# EAGLE schematic custom_keyboard (EAGLE 9.2.2)
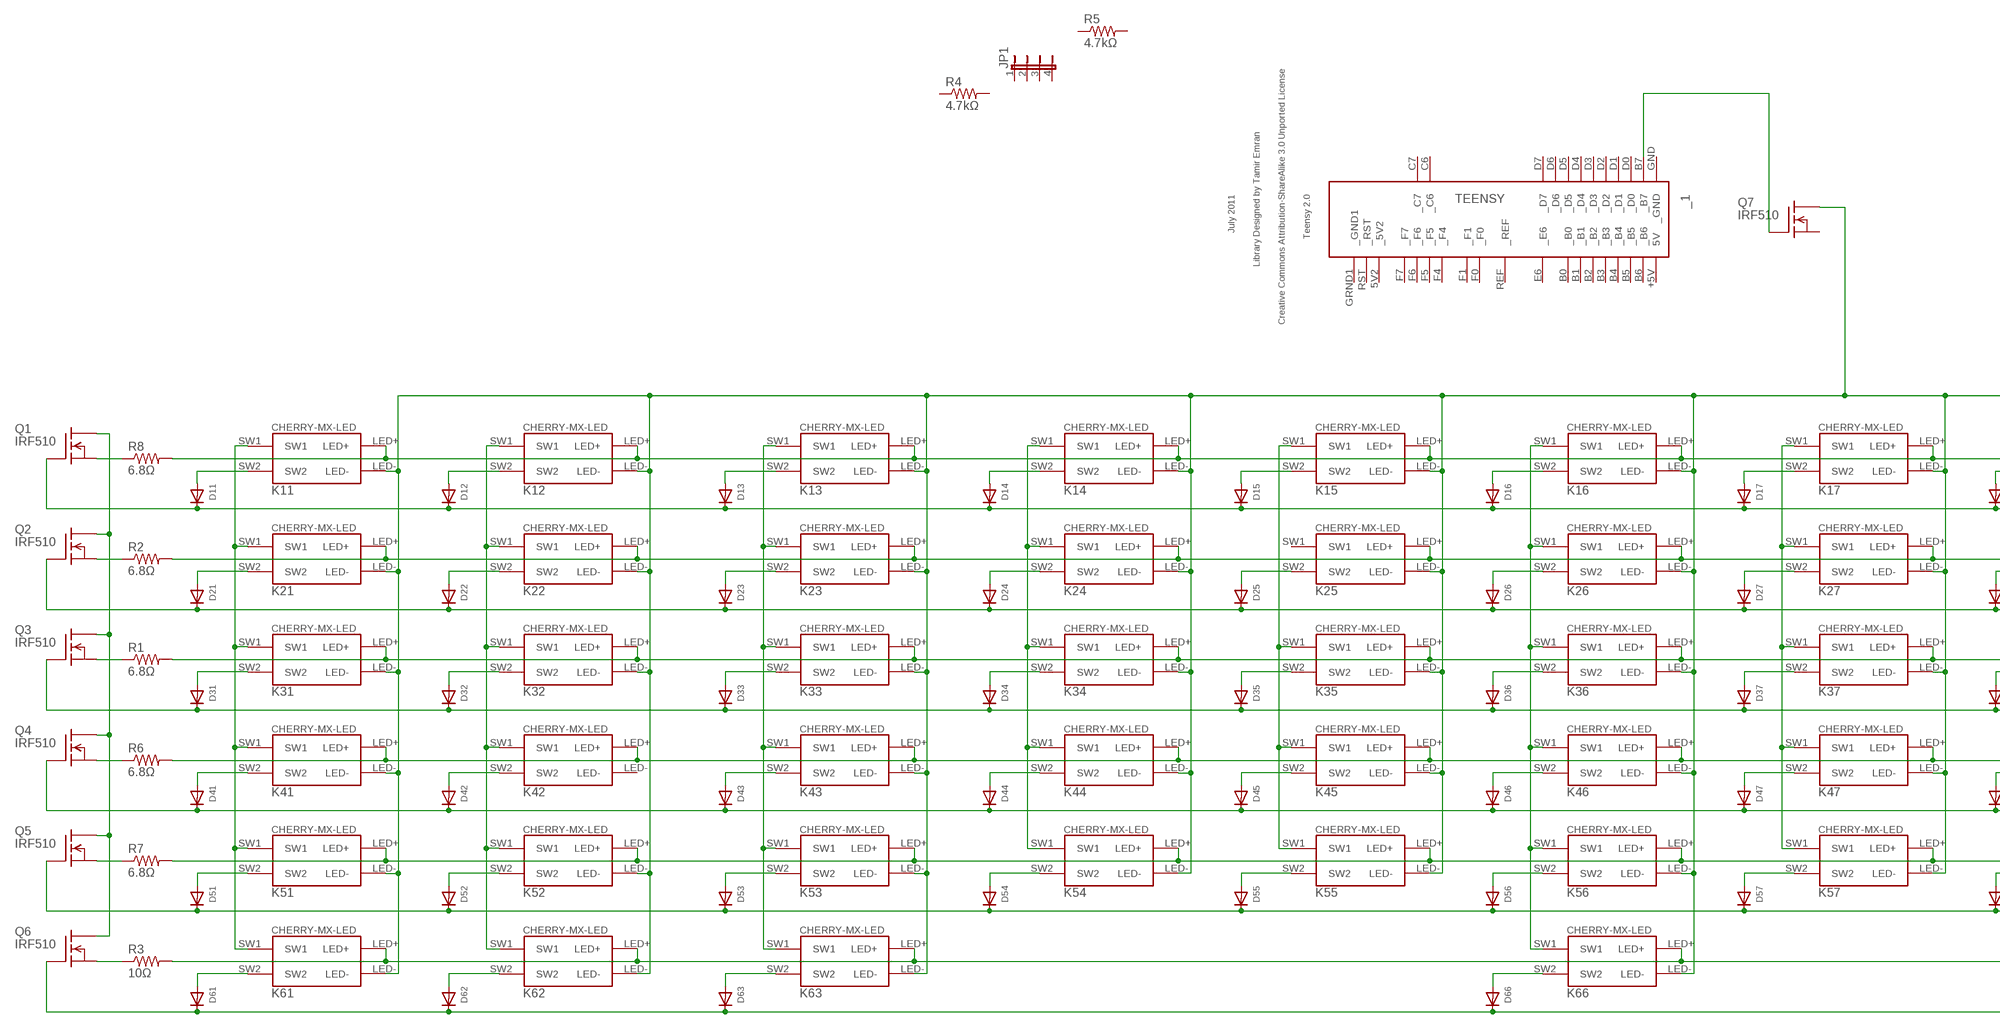
[diagram p0: schematic, sheet 1, part 1 of 2]
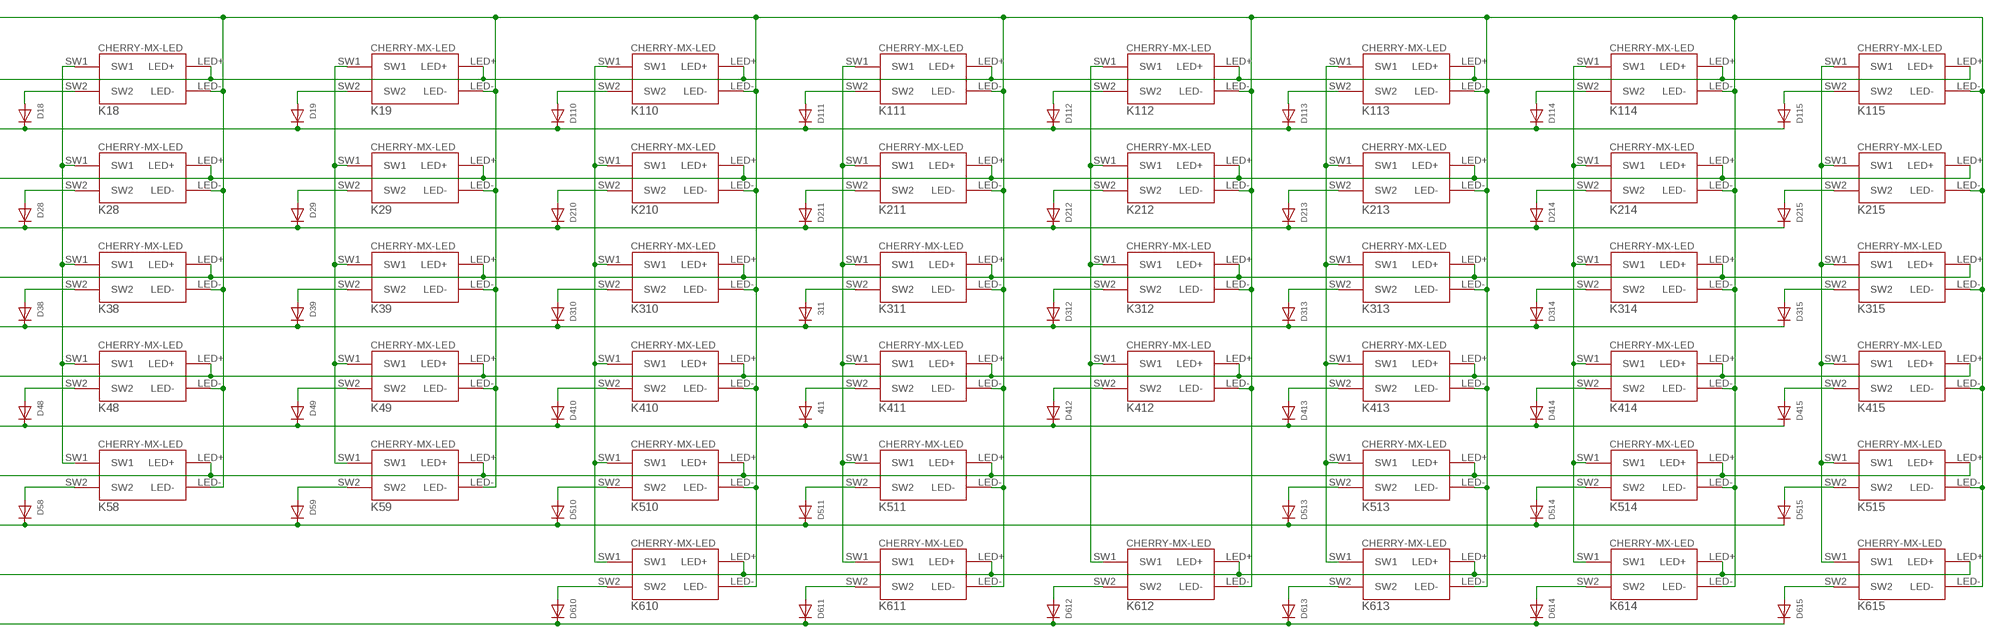
[diagram p1: schematic, sheet 1, part 2 of 2]

## Parts
311  DIODEDO-1N4148  [DO-1N4148]
411  DIODEDO-1N4148  [DO-1N4148]
_1  TEENSY  [TEENSY]
D11  DIODEDO-1N4148  [DO-1N4148]
D12  DIODEDO-1N4148  [DO-1N4148]
D13  DIODEDO-1N4148  [DO-1N4148]
D14  DIODEDO-1N4148  [DO-1N4148]
D15  DIODEDO-1N4148  [DO-1N4148]
D16  DIODEDO-1N4148  [DO-1N4148]
D17  DIODEDO-1N4148  [DO-1N4148]
D18  DIODEDO-1N4148  [DO-1N4148]
D19  DIODEDO-1N4148  [DO-1N4148]
D21  DIODEDO-1N4148  [DO-1N4148]
D22  DIODEDO-1N4148  [DO-1N4148]
D23  DIODEDO-1N4148  [DO-1N4148]
D24  DIODEDO-1N4148  [DO-1N4148]
D25  DIODEDO-1N4148  [DO-1N4148]
D26  DIODEDO-1N4148  [DO-1N4148]
D27  DIODEDO-1N4148  [DO-1N4148]
D28  DIODEDO-1N4148  [DO-1N4148]
D29  DIODEDO-1N4148  [DO-1N4148]
D31  DIODEDO-1N4148  [DO-1N4148]
D32  DIODEDO-1N4148  [DO-1N4148]
D33  DIODEDO-1N4148  [DO-1N4148]
D34  DIODEDO-1N4148  [DO-1N4148]
D35  DIODEDO-1N4148  [DO-1N4148]
D36  DIODEDO-1N4148  [DO-1N4148]
D37  DIODEDO-1N4148  [DO-1N4148]
D38  DIODEDO-1N4148  [DO-1N4148]
D39  DIODEDO-1N4148  [DO-1N4148]
D41  DIODEDO-1N4148  [DO-1N4148]
D42  DIODEDO-1N4148  [DO-1N4148]
D43  DIODEDO-1N4148  [DO-1N4148]
D44  DIODEDO-1N4148  [DO-1N4148]
D45  DIODEDO-1N4148  [DO-1N4148]
D46  DIODEDO-1N4148  [DO-1N4148]
D47  DIODEDO-1N4148  [DO-1N4148]
D48  DIODEDO-1N4148  [DO-1N4148]
D49  DIODEDO-1N4148  [DO-1N4148]
D51  DIODEDO-1N4148  [DO-1N4148]
D52  DIODEDO-1N4148  [DO-1N4148]
D53  DIODEDO-1N4148  [DO-1N4148]
D54  DIODEDO-1N4148  [DO-1N4148]
D55  DIODEDO-1N4148  [DO-1N4148]
D56  DIODEDO-1N4148  [DO-1N4148]
D57  DIODEDO-1N4148  [DO-1N4148]
D58  DIODEDO-1N4148  [DO-1N4148]
D59  DIODEDO-1N4148  [DO-1N4148]
D61  DIODEDO-1N4148  [DO-1N4148]
D62  DIODEDO-1N4148  [DO-1N4148]
D63  DIODEDO-1N4148  [DO-1N4148]
D66  DIODEDO-1N4148  [DO-1N4148]
D110  DIODEDO-1N4148  [DO-1N4148]
D111  DIODEDO-1N4148  [DO-1N4148]
D112  DIODEDO-1N4148  [DO-1N4148]
D113  DIODEDO-1N4148  [DO-1N4148]
D114  DIODEDO-1N4148  [DO-1N4148]
D115  DIODEDO-1N4148  [DO-1N4148]
D210  DIODEDO-1N4148  [DO-1N4148]
D211  DIODEDO-1N4148  [DO-1N4148]
D212  DIODEDO-1N4148  [DO-1N4148]
D213  DIODEDO-1N4148  [DO-1N4148]
D214  DIODEDO-1N4148  [DO-1N4148]
D215  DIODEDO-1N4148  [DO-1N4148]
D310  DIODEDO-1N4148  [DO-1N4148]
D312  DIODEDO-1N4148  [DO-1N4148]
D313  DIODEDO-1N4148  [DO-1N4148]
D314  DIODEDO-1N4148  [DO-1N4148]
D315  DIODEDO-1N4148  [DO-1N4148]
D410  DIODEDO-1N4148  [DO-1N4148]
D412  DIODEDO-1N4148  [DO-1N4148]
D413  DIODEDO-1N4148  [DO-1N4148]
D414  DIODEDO-1N4148  [DO-1N4148]
D415  DIODEDO-1N4148  [DO-1N4148]
D510  DIODEDO-1N4148  [DO-1N4148]
D511  DIODEDO-1N4148  [DO-1N4148]
D513  DIODEDO-1N4148  [DO-1N4148]
D514  DIODEDO-1N4148  [DO-1N4148]
D515  DIODEDO-1N4148  [DO-1N4148]
D610  DIODEDO-1N4148  [DO-1N4148]
D611  DIODEDO-1N4148  [DO-1N4148]
D612  DIODEDO-1N4148  [DO-1N4148]
D613  DIODEDO-1N4148  [DO-1N4148]
D614  DIODEDO-1N4148  [DO-1N4148]
D615  DIODEDO-1N4148  [DO-1N4148]
JP1  JP4E  [JP4]
K11  CHERRY-MX-LED  [CHERRY-MX-LED]
K12  CHERRY-MX-LED  [CHERRY-MX-LED]
K13  CHERRY-MX-LED  [CHERRY-MX-LED]
K14  CHERRY-MX-LED  [CHERRY-MX-LED]
K15  CHERRY-MX-LED  [CHERRY-MX-LED]
K16  CHERRY-MX-LED  [CHERRY-MX-LED]
K17  CHERRY-MX-LED  [CHERRY-MX-LED]
K18  CHERRY-MX-LED  [CHERRY-MX-LED]
K19  CHERRY-MX-LED  [CHERRY-MX-LED]
K21  CHERRY-MX-LED  [CHERRY-MX-LED]
K22  CHERRY-MX-LED  [CHERRY-MX-LED]
K23  CHERRY-MX-LED  [CHERRY-MX-LED]
K24  CHERRY-MX-LED  [CHERRY-MX-LED]
K25  CHERRY-MX-LED  [CHERRY-MX-LED]
K26  CHERRY-MX-LED  [CHERRY-MX-LED]
K27  CHERRY-MX-LED  [CHERRY-MX-LED]
K28  CHERRY-MX-LED  [CHERRY-MX-LED]
K29  CHERRY-MX-LED  [CHERRY-MX-LED]
K31  CHERRY-MX-LED  [CHERRY-MX-LED]
K32  CHERRY-MX-LED  [CHERRY-MX-LED]
K33  CHERRY-MX-LED  [CHERRY-MX-LED]
K34  CHERRY-MX-LED  [CHERRY-MX-LED]
K35  CHERRY-MX-LED  [CHERRY-MX-LED]
K36  CHERRY-MX-LED  [CHERRY-MX-LED]
K37  CHERRY-MX-LED  [CHERRY-MX-LED]
K38  CHERRY-MX-LED  [CHERRY-MX-LED]
K39  CHERRY-MX-LED  [CHERRY-MX-LED]
K41  CHERRY-MX-LED  [CHERRY-MX-LED]
K42  CHERRY-MX-LED  [CHERRY-MX-LED]
K43  CHERRY-MX-LED  [CHERRY-MX-LED]
K44  CHERRY-MX-LED  [CHERRY-MX-LED]
K45  CHERRY-MX-LED  [CHERRY-MX-LED]
K46  CHERRY-MX-LED  [CHERRY-MX-LED]
K47  CHERRY-MX-LED  [CHERRY-MX-LED]
K48  CHERRY-MX-LED  [CHERRY-MX-LED]
K49  CHERRY-MX-LED  [CHERRY-MX-LED]
K51  CHERRY-MX-LED  [CHERRY-MX-LED]
K52  CHERRY-MX-LED  [CHERRY-MX-LED]
K53  CHERRY-MX-LED  [CHERRY-MX-LED]
K54  CHERRY-MX-LED  [CHERRY-MX-LED]
K55  CHERRY-MX-LED  [CHERRY-MX-LED]
K56  CHERRY-MX-LED  [CHERRY-MX-LED]
K57  CHERRY-MX-LED  [CHERRY-MX-LED]
K58  CHERRY-MX-LED  [CHERRY-MX-LED]
K59  CHERRY-MX-LED  [CHERRY-MX-LED]
K61  CHERRY-MX-LED  [CHERRY-MX-LED]
K62  CHERRY-MX-LED  [CHERRY-MX-LED]
K63  CHERRY-MX-LED  [CHERRY-MX-LED]
K66  CHERRY-MX-LED  [CHERRY-MX-LED]
K110  CHERRY-MX-LED  [CHERRY-MX-LED]
K111  CHERRY-MX-LED  [CHERRY-MX-LED]
K112  CHERRY-MX-LED  [CHERRY-MX-LED]
K113  CHERRY-MX-LED  [CHERRY-MX-LED]
K114  CHERRY-MX-LED  [CHERRY-MX-LED]
K115  CHERRY-MX-LED  [CHERRY-MX-LED]
K210  CHERRY-MX-LED  [CHERRY-MX-LED]
K211  CHERRY-MX-LED  [CHERRY-MX-LED]
K212  CHERRY-MX-LED  [CHERRY-MX-LED]
K213  CHERRY-MX-LED  [CHERRY-MX-LED]
K214  CHERRY-MX-LED  [CHERRY-MX-LED]
K215  CHERRY-MX-LED  [CHERRY-MX-LED]
K310  CHERRY-MX-LED  [CHERRY-MX-LED]
K311  CHERRY-MX-LED  [CHERRY-MX-LED]
K312  CHERRY-MX-LED  [CHERRY-MX-LED]
K313  CHERRY-MX-LED  [CHERRY-MX-LED]
K314  CHERRY-MX-LED  [CHERRY-MX-LED]
K315  CHERRY-MX-LED  [CHERRY-MX-LED]
K410  CHERRY-MX-LED  [CHERRY-MX-LED]
K411  CHERRY-MX-LED  [CHERRY-MX-LED]
K412  CHERRY-MX-LED  [CHERRY-MX-LED]
K413  CHERRY-MX-LED  [CHERRY-MX-LED]
K414  CHERRY-MX-LED  [CHERRY-MX-LED]
K415  CHERRY-MX-LED  [CHERRY-MX-LED]
K510  CHERRY-MX-LED  [CHERRY-MX-LED]
K511  CHERRY-MX-LED  [CHERRY-MX-LED]
K513  CHERRY-MX-LED  [CHERRY-MX-LED]
K514  CHERRY-MX-LED  [CHERRY-MX-LED]
K515  CHERRY-MX-LED  [CHERRY-MX-LED]
K610  CHERRY-MX-LED  [CHERRY-MX-LED]
K611  CHERRY-MX-LED  [CHERRY-MX-LED]
K612  CHERRY-MX-LED  [CHERRY-MX-LED]
K613  CHERRY-MX-LED  [CHERRY-MX-LED]
K614  CHERRY-MX-LED  [CHERRY-MX-LED]
K615  CHERRY-MX-LED  [CHERRY-MX-LED]
Q1  IRF510  [TO220]
Q2  IRF510  [TO220]
Q3  IRF510  [TO220]
Q4  IRF510  [TO220]
Q5  IRF510  [TO220]
Q6  IRF510  [TO220]
Q7  IRF510  [TO220]
R1  6.8Ω  R-US_0411/12  [0411/12]
R2  6.8Ω  R-US_0411/12  [0411/12]
R3  10Ω  R-US_0411/12  [0411/12]
R4  4.7kΩ  R-US_0204/7  [0204/7]
R5  4.7kΩ  R-US_0204/7  [0204/7]
R6  6.8Ω  R-US_0411/12  [0411/12]
R7  6.8Ω  R-US_0411/12  [0411/12]
R8  6.8Ω  R-US_0411/12  [0411/12]

## Nets
N$1: D11.A K11.SW2
N$2: D12.A K12.SW2
N$3: D22.A K22.SW2
N$4: D21.A K21.SW2
N$5: D31.A K31.SW2
N$6: D41.A K41.SW2
N$7: D51.A K51.SW2
N$8: D61.A K61.SW2
N$9: D32.A K32.SW2
N$10: D42.A K42.SW2
N$11: D52.A K52.SW2
N$12: D62.A K62.SW2
N$13: D13.A K13.SW2
N$14: D23.A K23.SW2
N$15: D33.A K33.SW2
N$16: D43.A K43.SW2
N$17: D53.A K53.SW2
N$18: D63.A K63.SW2
N$19: D14.A K14.SW2
N$20: D24.A K24.SW2
N$21: D34.A K34.SW2
N$22: D44.A K44.SW2
N$23: D54.A K54.SW2
N$24: D11.C D12.C D13.C D14.C D15.C D16.C D17.C D18.C D19.C D110.C D111.C D112.C D113.C D114.C D115.C Q1.1(G)
N$25: D15.A K15.SW2
N$26: D25.A K25.SW2
N$27: D35.A K35.SW2
N$28: D45.A K45.SW2
N$29: D55.A K55.SW2
N$30: D21.C D22.C D23.C D24.C D25.C D26.C D27.C D28.C D29.C D210.C D211.C D212.C D213.C D214.C D215.C Q2.1(G)
N$31: D16.A K16.SW2
N$32: D26.A K26.SW2
N$33: D36.A K36.SW2
N$34: D46.A K46.SW2
N$35: D56.A K56.SW2
N$36: 311.C D31.C D32.C D33.C D34.C D35.C D36.C D37.C D38.C D39.C D310.C D312.C D313.C D314.C D315.C Q3.1(G)
N$37: D17.A K17.SW2
N$38: D27.A K27.SW2
N$39: D37.A K37.SW2
N$40: D47.A K47.SW2
N$41: D57.A K57.SW2
N$42: D66.A K66.SW2
N$43: D18.A K18.SW2
N$44: D28.A K28.SW2
N$45: D38.A K38.SW2
N$46: D48.A K48.SW2
N$47: D58.A K58.SW2
N$48: 411.C D41.C D42.C D43.C D44.C D45.C D46.C D47.C D48.C D49.C D410.C D412.C D413.C D414.C D415.C Q4.1(G)
N$49: D19.A K19.SW2
N$50: D29.A K29.SW2
N$51: D39.A K39.SW2
N$52: D49.A K49.SW2
N$53: D59.A K59.SW2
N$54: D51.C D52.C D53.C D54.C D55.C D56.C D57.C D58.C D59.C D510.C D511.C D513.C D514.C D515.C Q5.1(G)
N$55: D110.A K110.SW2
N$56: D210.A K210.SW2
N$57: D310.A K310.SW2
N$58: D410.A K410.SW2
N$59: D510.A K510.SW2
N$60: D610.A K610.SW2
N$61: D111.A K111.SW2
N$62: D211.A K211.SW2
N$63: 311.A K311.SW2
N$64: 411.A K411.SW2
N$65: D511.A K511.SW2
N$66: D611.A K611.SW2
N$67: D112.A K112.SW2
N$68: D212.A K212.SW2
N$69: D312.A K312.SW2
N$70: D412.A K412.SW2
N$71: D61.C D62.C D63.C D66.C D610.C D611.C D612.C D613.C D614.C D615.C Q6.1(G)
N$72: D612.A K612.SW2
N$73: D113.A K113.SW2
N$74: D213.A K213.SW2
N$75: D313.A K313.SW2
N$76: D413.A K413.SW2
N$77: D513.A K513.SW2
N$78: D613.A K613.SW2
N$79: D114.A K114.SW2
N$80: D214.A K214.SW2
N$81: D314.A K314.SW2
N$82: D414.A K414.SW2
N$83: D514.A K514.SW2
N$84: D614.A K614.SW2
N$85: D115.A K115.SW2
N$86: D215.A K215.SW2
N$87: D315.A K315.SW2
N$88: D415.A K415.SW2
N$89: D515.A K515.SW2
N$90: D615.A K615.SW2
N$91: K11.SW1 K21.SW1 K31.SW1 K41.SW1 K51.SW1 K61.SW1
N$92: K12.SW1 K22.SW1 K32.SW1 K42.SW1 K52.SW1 K62.SW1
N$93: K13.SW1 K23.SW1 K33.SW1 K43.SW1 K53.SW1 K63.SW1
N$94: K14.SW1 K24.SW1 K34.SW1 K44.SW1 K54.SW1
N$95: K115.SW1 K215.SW1 K315.SW1 K415.SW1 K515.SW1 K615.SW1
N$96: K114.SW1 K214.SW1 K314.SW1 K414.SW1 K514.SW1 K614.SW1
N$97: K113.SW1 K213.SW1 K313.SW1 K413.SW1 K513.SW1 K613.SW1
N$98: K112.SW1 K212.SW1 K312.SW1 K412.SW1 K612.SW1
N$99: K111.SW1 K211.SW1 K311.SW1 K411.SW1 K511.SW1 K611.SW1
N$100: K110.SW1 K210.SW1 K310.SW1 K410.SW1 K510.SW1 K610.SW1
N$101: K19.SW1 K29.SW1 K39.SW1 K49.SW1 K59.SW1
N$102: K18.SW1 K28.SW1 K38.SW1 K48.SW1 K58.SW1
N$103: K17.SW1 K27.SW1 K37.SW1 K47.SW1 K57.SW1
N$104: K16.SW1 K26.SW1 K36.SW1 K46.SW1 K56.SW1 K66.SW1
N$105: K15.SW1 K35.SW1 K45.SW1 K55.SW1
N$106: Q1.3(S) R8.1
N$107: Q2.3(S) R2.1
N$108: Q3.3(S) R1.1
N$109: Q4.3(S) R6.1
N$110: Q5.3(S) R7.1
N$111: Q1.2(D) Q2.2(D) Q3.2(D) Q4.2(D) Q5.2(D) Q6.2(D)
N$112: Q6.3(S) R3.1
N$113: K11.LED- K12.LED- K13.LED- K14.LED- K15.LED- K16.LED- K17.LED- K18.LED- K19.LED- K21.LED- K22.LED- K23.LED- K24.LED- K25.LED- K26.LED- K27.LED- K28.LED- K29.LED- K31.LED- K32.LED- K33.LED- K34.LED- K35.LED- K36.LED- K37.LED- K38.LED- K39.LED- K41.LED- K43.LED- K44.LED- K45.LED- K46.LED- K47.LED- K48.LED- K49.LED- K51.LED- K52.LED- K53.LED- K54.LED- K55.LED- K56.LED- K57.LED- K58.LED- K59.LED- K61.LED- K62.LED- K63.LED- K66.LED- K110.LED- K111.LED- K112.LED- K113.LED- K114.LED- K115.LED- K210.LED- K211.LED- K212.LED- K213.LED- K214.LED- K215.LED- K310.LED- K311.LED- K312.LED- K313.LED- K314.LED- K315.LED- K410.LED- K411.LED- K412.LED- K413.LED- K414.LED- K415.LED- K510.LED- K511.LED- K513.LED- K514.LED- K515.LED- K610.LED- K611.LED- K612.LED- K613.LED- K614.LED- K615.LED- Q7.2(D)
N$127: K11.LED+ K12.LED+ K13.LED+ K14.LED+ K15.LED+ K16.LED+ K17.LED+ K18.LED+ K19.LED+ K110.LED+ K111.LED+ K112.LED+ K113.LED+ K114.LED+ K115.LED+ R8.2
N$128: K21.LED+ K22.LED+ K23.LED+ K24.LED+ K25.LED+ K26.LED+ K27.LED+ K28.LED+ K29.LED+ K210.LED+ K211.LED+ K212.LED+ K213.LED+ K214.LED+ K215.LED+ R2.2
N$129: K31.LED+ K32.LED+ K33.LED+ K34.LED+ K35.LED+ K36.LED+ K37.LED+ K38.LED+ K39.LED+ K310.LED+ K311.LED+ K312.LED+ K313.LED+ K314.LED+ K315.LED+ R1.2
N$130: K41.LED+ K42.LED+ K43.LED+ K44.LED+ K45.LED+ K46.LED+ K47.LED+ K48.LED+ K49.LED+ K410.LED+ K411.LED+ K412.LED+ K413.LED+ K414.LED+ K415.LED+ R6.2
N$131: K51.LED+ K52.LED+ K53.LED+ K54.LED+ K55.LED+ K56.LED+ K57.LED+ K58.LED+ K59.LED+ K510.LED+ K511.LED+ K513.LED+ K514.LED+ K515.LED+ R7.2
N$132: K61.LED+ K62.LED+ K63.LED+ K66.LED+ K610.LED+ K611.LED+ K612.LED+ K613.LED+ K614.LED+ K615.LED+ R3.2
N$133: _1.B7(_B7) Q7.1(G)
Unconnected: _1.5V2(_5V2) _1.+5V(5V) _1.B0(_B0) _1.B1(_B1) _1.B2(_B2) _1.B3(_B3) _1.B4(_B4) _1.B5(_B5) _1.B6(_B6) _1.C6(_C6) _1.C7(_C7) _1.D0(_D0) _1.D1(_D1) _1.D2(_D2) _1.D3(_D3) _1.D4(_D4) _1.D5(_D5) _1.D6(_D6) _1.D7(_D7) _1.E6(_E6) _1.F0(_F0) _1.F1(_F1) _1.F4(_F4) _1.F5(_F5) _1.F6(_F6) _1.F7(_F7) _1.GND(_GND) _1.GRND1(_GND1) _1.REF(_REF) _1.RST(_RST) JP1.1 JP1.2 JP1.3 JP1.4 K25.SW1 K42.LED- Q7.3(S) R4.1 R4.2 R5.1 R5.2

## Library data of the parts
311 411 D11-D19 D21-D29 D31-D39 D41-D49 D51-D59 D61-D63 D66 D110-D115 D210-D215 D310 D312-D315 D410 D412-D415 D510 D511 D513-D515 D610-D615 = adafruit:DIODE: Diode SMADIODE - SMA Surface Mount Package 20V 1A Schottky Diode Digikey: 641-1014-6-ND DO-1N4148 - Through Hole Small Current Diode SOD-123 20V 1 A (.5mV Vf) Schottky Diode - Digikey: MBRX120TPMSCT-ND SOD-323 10V 570mA (.38mV Vf, 3ns) Schottky Diode - Digikey: ZLLS410CT-ND SOD-523 30V 30mA Schottky Diode (RB751S-40TE61) - Digikey: RB751S-40TE61CT-ND SOT23-R/W - SOT23 Package (R = Solder Paste/Reflow Ovens, W = Hand-Soldering) BAT54Film 40V 300mA - Digikey: 497-7162-1-ND
_1 = teensy:TEENSY: Teensy 2.0 Original Design by Clint Fisher Modified Design by Tamir Emran Licensed Under Creative Commons Attribution-ShareAlike 3.0 Unported (CC BY-SA 3.0)
JP1 = jumper:JP4E: JUMPER
K11-K19 K21-K29 K31-K39 K41-K49 K51-K59 K61-K63 K66 K110-K115 K210-K215 K310-K315 K410-K415 K510 K511 K513-K515 K610-K615 = cherrymx:CHERRY-MX-LED: Cherry MX series keyswitch with LED
Q1-Q7 = transistor-fet:IRF510: N-Channel Enhancement MOSFET (HEXFET); 100V; 5,6A; 0,54Ohm
R1-R8 = rcl:R-US_: RESISTOR, American symbol; SPICEPREFIX: R